# EAGLE design myRIO circuit breakout (EAGLE 9.5.0)
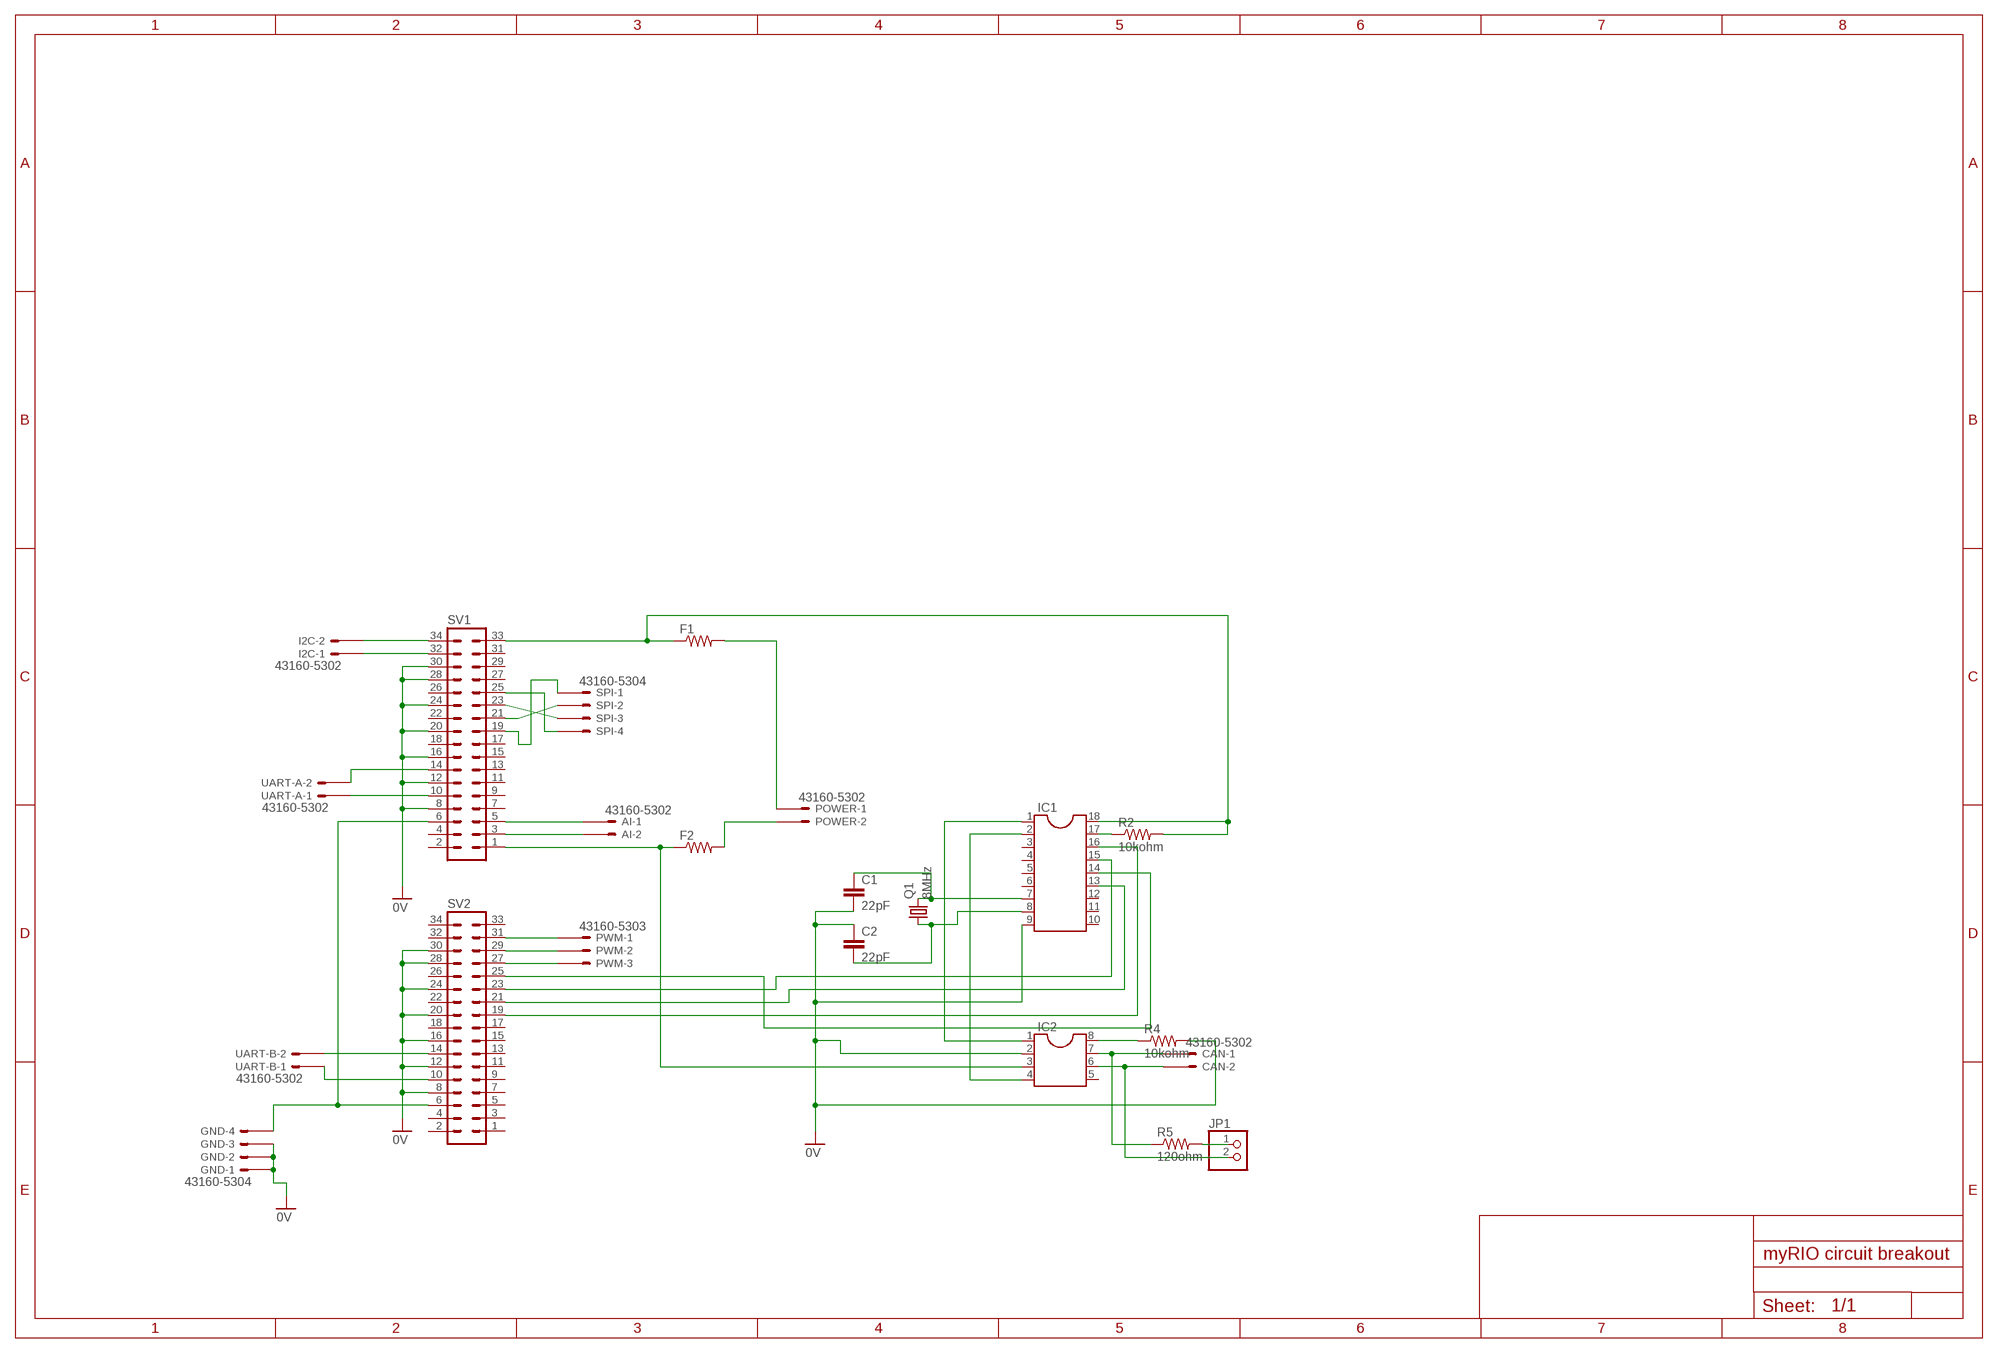
[diagram p0: schematic, sheet 1]

## Parts
AI  43160-5302  [43160-XX02]
C1  22pF  C2,5-3  [C2.5-3]
C2  22pF  C2,5-3  [C2.5-3]
CAN  43160-5302  [43160-XX02]
F1  R-US_R1206  [R1206]
F2  R-US_R1206  [R1206]
GND  43160-5304  [43160-XX04]
I2C  43160-5302  [43160-XX02]
IC1  DIL18  [DIL18]
IC2  DIL8  [DIL08]
JP1  PINHD-1X2  [1X02]
POWER  43160-5302  [43160-XX02]
PWM  43160-5303  [43160-XX03]
Q1  8MHz  CRYSTALHC49S  [HC49/S]
R2  10kohm  R-US_0204/7  [0204/7]
R4  10kohm  R-US_0204/7  [0204/7]
R5  120ohm  R-US_0204/7  [0204/7]
SPI  43160-5304  [43160-XX04]
SV1  MA17-2  [MA17-2]
SV2  MA17-2  [MA17-2]
UART-A  43160-5302  [43160-XX02]
UART-B  43160-5302  [43160-XX02]

## Nets
0V: C1.2 C2.1 GND.1@1(-1:S) GND.2@1(-2:S) GND.3@1(-3:S) IC1.9 IC2.2 R4.2 SV1.8 SV1.12 SV1.16 SV1.20 SV1.24 SV1.28 SV1.30 SV2.8 SV2.12 SV2.16 SV2.20 SV2.24 SV2.28 SV2.30
N$1: I2C.2@1(-2:S) SV1.34
N$2: I2C.1@1(-1:S) SV1.32
N$3: SPI.4@1(-4:S) SV1.25
N$4: SPI.2@1(-2:S) SV1.21
N$5: SPI.3@1(-3:S) SV1.23
N$6: SPI.1@1(-1:S) SV1.19
N$7: AI.2@1(-2:S) SV1.3
N$8: AI.1@1(-1:S) SV1.5
N$9: JP1.1 R5.2
N$11: SV1.10 UART-A.1@1(-1:S)
N$12: SV1.14 UART-A.2@1(-2:S)
N$13: SV2.10 UART-B.1@1(-1:S)
N$14: SV2.14 UART-B.2@1(-2:S)
N$15: GND.4@1(-4:S) SV1.6 SV2.6
N$16: IC1.1 IC2.1
N$17: IC1.2 IC2.4
N$18: C1.1 IC1.7 Q1.2
N$20: PWM.1@1(-1:S) SV2.31
N$21: PWM.2@1(-2:S) SV2.29
N$22: PWM.3@1(-3:S) SV2.27
N$26: F1.1 IC1.18 R2.2 SV1.33
N$27: F1.2 POWER.1@1(-1:S)
N$28: F2.1 IC2.3 SV1.1
N$29: F2.2 POWER.2@1(-2:S)
N$30: C2.2 IC1.8 Q1.1
N$31: IC1.17 R2.1
N$32: IC1.16 SV2.19
N$33: IC1.13 SV2.21
N$34: IC1.15 SV2.23
N$35: IC1.14 SV2.25
N$36: IC2.8 R4.1
N$37: CAN.1@1(-1:S) IC2.7 R5.1
N$38: CAN.2@1(-2:S) IC2.6 JP1.2
Unconnected: AI.1@2(-1:S) AI.2@2(-2:S) CAN.1@2(-1:S) CAN.2@2(-2:S) GND.1@2(-1:S) GND.2@2(-2:S) GND.3@2(-3:S) GND.4@2(-4:S) I2C.1@2(-1:S) I2C.2@2(-2:S) IC1.3 IC1.4 IC1.5 IC1.6 IC1.10 IC1.11 IC1.12 IC2.5 POWER.1@2(-1:S) POWER.2@2(-2:S) PWM.1@2(-1:S) PWM.2@2(-2:S) PWM.3@2(-3:S) SPI.1@2(-1:S) SPI.2@2(-2:S) SPI.3@2(-3:S) SPI.4@2(-4:S) SV1.2 SV1.4 SV1.7 SV1.9 SV1.11 SV1.13 SV1.15 SV1.17 SV1.18 SV1.22 SV1.26 SV1.27 SV1.29 SV1.31 SV2.1 SV2.2 SV2.3 SV2.4 SV2.5 SV2.7 SV2.9 SV2.11 SV2.13 SV2.15 SV2.17 SV2.18 SV2.22 SV2.26 SV2.32 SV2.33 SV2.34 UART-A.1@2(-1:S) UART-A.2@2(-2:S) UART-B.1@2(-1:S) UART-B.2@2(-2:S)

## Library data of the parts
AI CAN I2C POWER UART-A UART-B = con-molex:43160-*02: SDA-43160 Connector Source: http://www.molex.com/pdm_docs/sd/431601306_sd.pdf; MF: MOLEX; MPN: 43160-5302; OC_FARNELL: unknown; OC_NEWARK: 92M1498
C1 C2 = capacitor-wima:C: CAPACITOR naming: grid - package width
F1 F2 R2 R4 R5 = rcl:R-US_: RESISTOR, American symbol; SPICEPREFIX: R
GND SPI = con-molex:43160-*04: SDA-43160 Connector Source: http://www.molex.com/pdm_docs/sd/431601306_sd.pdf; MF: MOLEX; MPN: 43160-5304; OC_FARNELL: unknown; OC_NEWARK: 92M1500
IC1 = ic-package:DIL18: Dual In Line / Socket
IC2 = ic-package:DIL8: Dual In Line / Socket
JP1 = pinhead:PINHD-1X2: PIN HEADER
PWM = con-molex:43160-*03: SDA-43160 Connector Source: http://www.molex.com/pdm_docs/sd/431601306_sd.pdf; MF: MOLEX; MPN: 43160-5303; OC_FARNELL: unknown; OC_NEWARK: 92M1499
Q1 = crystal:CRYSTAL: CRYSTAL; OC_FARNELL: 1667008; OC_NEWARK: unknown
SV1 SV2 = con-lstb:MA17-2: PIN HEADER; OC_FARNELL: unknown; OC_NEWARK: unknown

## Module TSS
Ports: 

### Library data of the parts

## Board
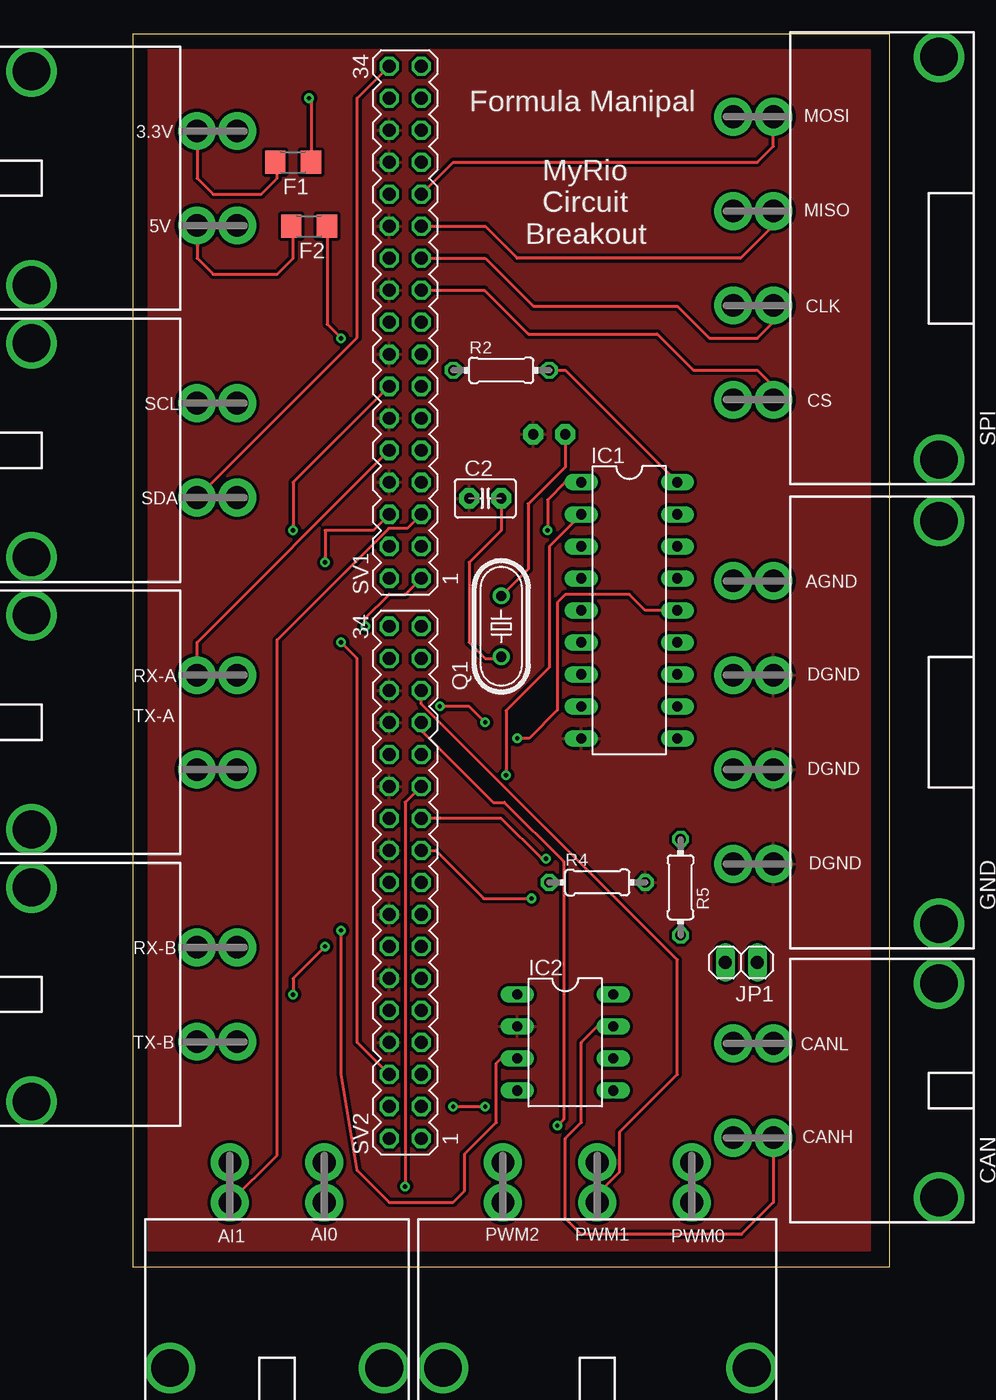
[diagram p1: board, top side]
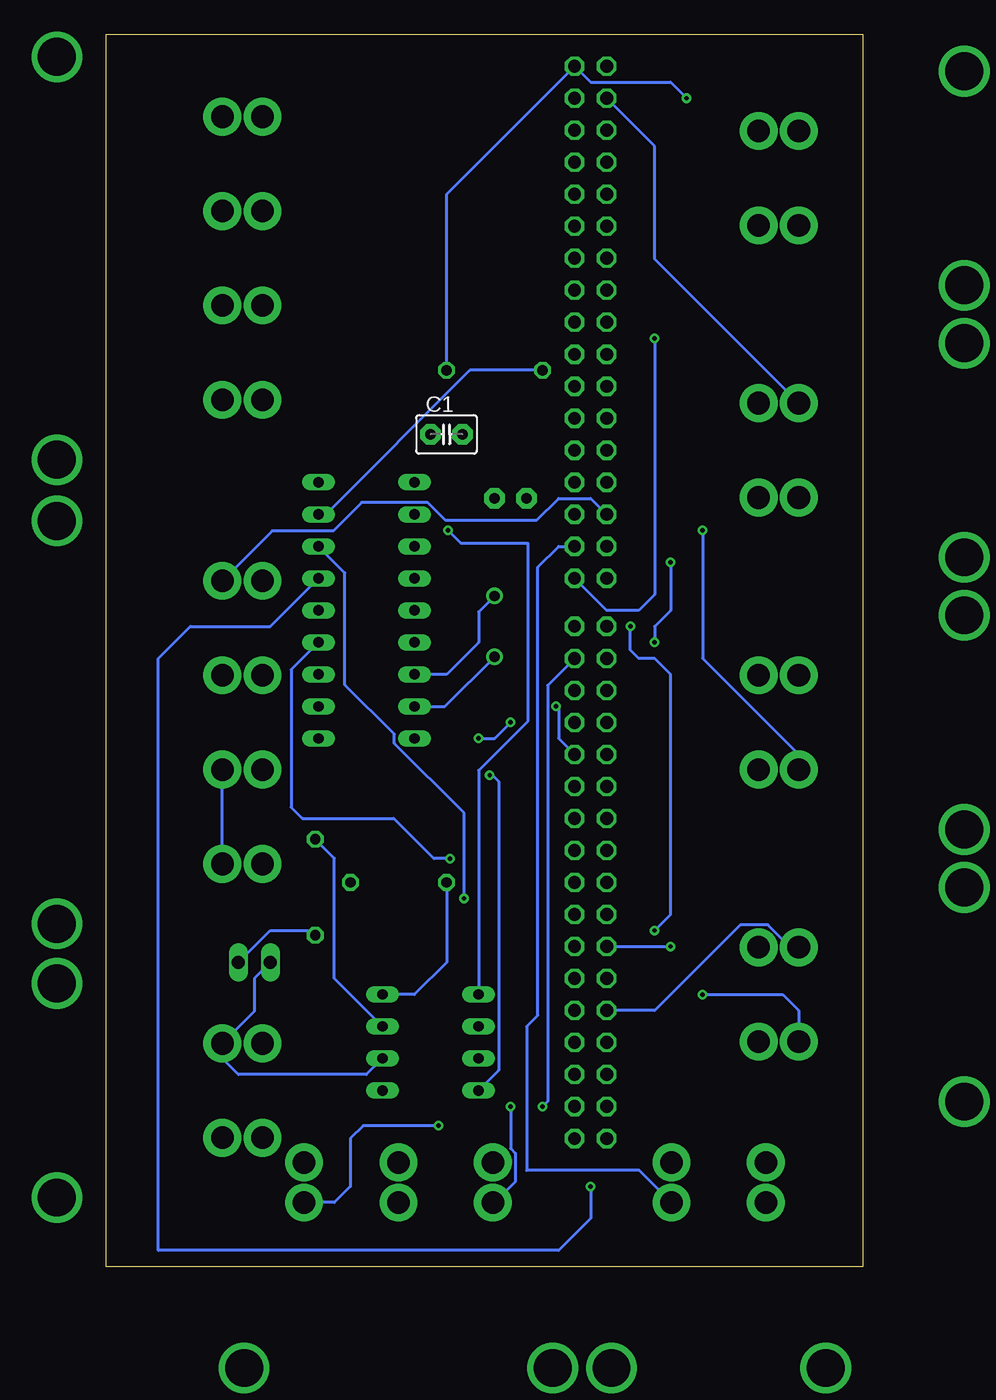
[diagram p2: board, bottom side, seen from below]

Size 60.02 x 97.78 mm. Coordinates in mm from the lower left corner, seen from the top.
Outline: 0,0 60.02,0 60.02,97.78 0,97.78 0,0
Copper layers (1*16): Top 0.035mm / dielectric 1.5mm / Bottom 0.035mm
Design rules "default": minimum track width 6mil, minimum drill 0.35mm, track to track 6mil, track to pad 6mil, pad to pad 6mil, via to via 6mil, smd to smd 6mil, copper to edge 40mil, drill to drill 6mil, minimum pad ring 10mil, minimum via ring 8mil, stop-mask expansion 4mil, vias tented up to drill 0mil, thermal gap 10mil

### Footprints (pad centres in the part's own frame; a part is rotated, then mirrored left to right if it is on the bottom)
43160-XX02 = drill 1.8 pad 3: 1@1 -3.745,0; 1@2 -3.745,3.18; 2@1 3.745,0; 2@2 3.745,3.18 | drill 3 pad 3.4: M1 -8.495,-13.13; M2 8.495,-13.13
C2.5-3 = drill 0.813 pad 1.6 octagon: 1 -1.27,0; 2 1.27,0
R1206 = smd 1.6 x 1.803: 1 -1.422,0; 2 1.422,0
43160-XX04 = drill 1.8 pad 3: 1@1 -11.235,0; 1@2 -11.235,3.18; 2@1 -3.745,0; 2@2 -3.745,3.18; 3@1 3.745,0; 3@2 3.745,3.18; 4@1 11.235,0; 4@2 11.235,3.18 | drill 3 pad 3.4: M1 -15.985,-13.13; M2 15.985,-13.13
DIL18 = drill 0.813 long: 1 -10.16,-3.81; 2 -7.62,-3.81; 3 -5.08,-3.81; 4 -2.54,-3.81; 5 0,-3.81; 6 2.54,-3.81; 7 5.08,-3.81; 8 7.62,-3.81; 9 10.16,-3.81; 10 10.16,3.81; 11 7.62,3.81; 12 5.08,3.81; 13 2.54,3.81; 14 0,3.81; 15 -2.54,3.81; 16 -5.08,3.81; 17 -7.62,3.81; 18 -10.16,3.81
DIL08 = drill 0.813 long: 1 -3.81,-3.81; 2 -1.27,-3.81; 3 1.27,-3.81; 4 3.81,-3.81; 5 3.81,3.81; 6 1.27,3.81; 7 -1.27,3.81; 8 -3.81,3.81
1X02 = drill 1.016 long: 1 -1.27,0; 2 1.27,0
43160-XX03 = drill 1.8 pad 3: 1@1 -7.49,0; 1@2 -7.49,3.18; 2@1 0,0; 2@2 0,3.18; 3@1 7.49,0; 3@2 7.49,3.18 | drill 3 pad 3.4: M1 -12.24,-13.13; M2 12.24,-13.13
HC49/S = drill 0.813: 1 -2.413,0; 2 2.413,0
0204/7 = drill 0.813 octagon: 1 -3.81,0; 2 3.81,0
MA17-2 = drill 1.016 octagon: 1 -20.32,-1.27; 2 -20.32,1.27; 3 -17.78,-1.27; 4 -17.78,1.27; 5 -15.24,-1.27; 6 -15.24,1.27; 7 -12.7,-1.27; 8 -12.7,1.27; 9 -10.16,-1.27; 10 -10.16,1.27; 11 -7.62,-1.27; 12 -7.62,1.27; 13 -5.08,-1.27; 14 -5.08,1.27; 15 -2.54,-1.27; 16 -2.54,1.27; 17 0,-1.27; 18 0,1.27; 19 2.54,-1.27; 20 2.54,1.27; 21 5.08,-1.27; 22 5.08,1.27; 23 7.62,-1.27; 24 7.62,1.27; 25 10.16,-1.27; 26 10.16,1.27; 27 12.7,-1.27; 28 12.7,1.27; 29 15.24,-1.27; 30 15.24,1.27; 31 17.78,-1.27; 32 17.78,1.27; 33 20.32,-1.27; 34 20.32,1.27

### Placement (x,y rotation side)
AI  11.43,5.08 0 top
C1  33.02,66.04 0 bottom
C2  27.94,60.96 0 top
CAN  50.8,13.97 90 top
F1  12.7,87.63 180 top
F2  13.97,82.55 180 top
GND  50.8,43.18 90 top
I2C  5.08,64.77 270 top
IC1  39.37,52.07 270 top
IC2  34.29,17.78 270 top
JP1  48.26,24.13 180 top
POWER  5.08,86.36 270 top
PWM  36.83,5.08 0 top
Q1  29.21,50.8 90 top
R2  29.21,71.12 0 top
R4  36.83,30.48 0 top
R5  43.43,30.1 270 top
SPI  50.8,80.01 90 top
SV1  21.59,74.93 90 top
SV2  21.59,30.48 90 top
UART-A  5.08,43.18 270 top
UART-B  5.08,21.59 270 top

### Tracks (layer width: path | path; a pad name or v marks a point on that pad's centre or on a via)
0V
  Bottom 0.254: GND.1@1 GND.2@1
  pour Top (isolate 0.254): 1.27,96.52 58.42,96.52 58.42,1.27 1.27,1.27
N$1
  Top 0.254: I2C.2@1 17.78,73.72 17.78,92.71 SV1.34
N$2
  Bottom 0.254: I2C.1@1 16.51,79.94 16.51,88.9 SV1.32
N$3
  Top 0.254: SV1.25 25.4,87.63 49.53,87.63 50.8,88.9 SPI.4@1
N$4
  Top 0.254: SV1.21 27.94,80.01 31.75,76.2 43.18,76.2 45.72,73.66 49.53,73.66 50.8,74.93 SPI.2@1
N$5
  Top 0.254: SV1.23 27.94,82.55 30.48,80.01 48.19,80.01 50.8,82.62 SPI.3@1
N$6
  Top 0.254: SV1.19 27.88,77.47 31.36,73.99 41.58,73.99 44.45,71.12 49.53,71.12 50.8,69.85 SPI.1@1
N$7
  Bottom 0.254: AI.2@1 17.71,7.62 26.67,7.62 26.67,19.05 25.78,19.94 25.78,55.5 24.13,57.15 SV1.3
N$8
  Top 0.254: AI.1@1 11.43,8.82 11.43,49.73 20.27,58.57 21.74,58.57 SV1.5
N$9
  Bottom 0.254: JP1.1 46.99,26.67 43.81,26.67 R5.2
N$11
  Top 0.254: UART-A.1@1 5.08,49.53 SV1.10
N$12  (via drill 0.35)
  Top 0.254: SV1.14 12.7,62.23 v12.7,58.42
  Bottom 0.254: v12.7,58.42 12.7,48.26 5.08,40.64 UART-A.2@1
N$13
  Bottom 0.254: UART-B.1@1 5.74,25.34 7.52,27.11 9.72,27.11 16.51,20.32 SV2.10
N$14  (via drill 0.35)
  Top 0.254: v15.24,25.4 12.7,22.86 v12.7,21.59
  Bottom 0.254: SV2.14 v15.24,25.4 | v12.7,21.59 6.35,21.59 5.08,20.32 UART-B.2@1
N$15  (via drill 0.35)
  Top 0.254: SV2.6 17.78,17.78 17.78,48.26 v16.51,49.53 | SV1.6 19.05,58.42 15.24,58.42 v15.24,55.88
  Bottom 0.254: GND.4@1 46.85,58.37 42,58.37 39.74,60.63 34.51,60.63 33.13,59.24 25.85,59.24 24.13,60.96 21.59,60.96 SV1.6 | v15.24,55.88 15.24,52.07 16.51,50.8 v16.51,49.53
N$16  (via drill 0.35)
  Top 0.254: IC1.1 34.29,62.23 32.89,60.83 v32.89,58.42
  Bottom 0.254: IC2.1 30.48,39.37 26.54,43.31 26.54,57.4 31.88,57.4 v32.89,58.42
N$17  (via drill 0.35)
  Top 0.254: v29.59,38.99 29.59,44.11 33.02,47.54 33.02,57.15 IC1.2
  Bottom 0.254: v29.59,38.99 29.38,38.99 28.88,38.49 28.88,15.57 IC2.4
N$18
  Top 0.254: C1.1 34.29,63.46 31.34,60.51 31.34,55.35 Q1.2
  Bottom 0.254: Q1.2 30.48,51.94 30.48,49.53 33.02,46.99 IC1.7
N$20  (via drill 0.35)
  Top 0.254: v25.4,12.7 v27.94,12.7
  Bottom 0.254: PWM.1@1 29.28,5.02 27.56,6.73 27.56,9 27.94,9.38 v27.94,12.7 | SV2.31 24.99,46.13 24.99,13.11 v25.4,12.7
N$21
  Top 0.254: PWM.2@1 36.83,5.74 38.61,7.52 38.61,10.67 43.18,15.24 43.18,24.33 22.86,44.65 SV2.29
N$22  (via drill 0.35)
  Top 0.254: SV2.27 22.86,42.55 28.57,36.83 29.46,36.83 34.16,32.13 34.16,11.68 v33.66,11.18
  Bottom 0.254: v33.66,11.18 39.62,11.18 40.64,10.16 40.64,6.35 41.91,5.08 PWM.3@1
N$26  (via drill 0.35)
  Top 0.254: IC1.18 34.29,71.12 R2.2 | v13.97,92.71 14.12,92.56 F1.1
  Bottom 0.254: R2.2 33.02,85.09 SV1.33 21.59,93.98 15.24,93.98 v13.97,92.71
N$27
  Top 0.254: POWER.1@1 5.08,86.36 6.35,85.09 10.16,85.09 11.43,86.36 11.43,87.48 F1.2
N$28  (via drill 0.35)
  Top 0.254: IC2.3 29.21,16.51 28.83,16.13 28.83,11.43 26.29,8.89 26.29,5.97 25.4,5.08 20.32,5.08 17.78,7.62 16.51,15.24 v16.51,26.67 | F2.1 15.39,74.78 v16.51,73.66 | v18.44,50.8 18.44,51.46 20.32,53.34 21.59,53.34 SV1.1
  Bottom 0.254: v16.51,73.66 16.51,53.34 17.78,52.07 20.32,52.07 SV1.1 | v16.51,26.67 15.24,27.94 15.24,46.99 16.51,48.26 17.78,48.26 18.44,48.92 v18.44,50.8
N$29
  Top 0.254: POWER.2@1 5.08,80.01 6.35,78.74 11.43,78.74 12.7,80.01 12.7,82.4 F2.2
N$30
  Top 0.254: C2.2 29.21,58.42 26.67,55.88 26.67,49.53 27.94,48.26 29.08,48.26 Q1.1
  Bottom 0.254: IC1.8 33.15,44.45 Q1.1
N$31
  Bottom 0.254: R2.1 31.16,71.12 42.59,59.69 IC1.17
N$32  (via drill 0.35)
  Top 0.254: SV2.19 24,33.02 27.81,29.21 v31.62,29.21
  Bottom 0.254: v31.62,29.21 31.62,35.98 37.16,41.52 37.16,42.24 41.07,46.15 41.07,55.04 IC1.16
N$33  (via drill 0.35)
  Top 0.254: v32.75,32.37 32.41,32.37 29.21,35.56 SV2.21
  Bottom 0.254: IC1.13 45.34,47.37 45.34,36.45 44.45,35.56 37.21,35.56 34.02,32.37 v32.75,32.37
N$34  (via drill 0.35)
  Top 0.254: SV2.23 21.59,36.83 v21.59,6.35
  Bottom 0.254: v21.59,6.35 21.59,3.81 24.13,1.27 55.88,1.27 55.88,48.26 53.34,50.8 46.99,50.8 IC1.15
N$35  (via drill 0.35)
  Top 0.254: IC1.14 40.64,52.07 39.37,53.34 34.29,53.34 33.66,52.71 33.66,44.15 31.42,41.91 v30.48,41.91 | v27.94,43.18 26.67,44.45 v24.34,44.45
  Bottom 0.254: v30.48,41.91 29.21,41.91 v27.94,43.18 | v24.34,44.45 24.13,44.24 24.13,41.91 SV2.25
N$36
  Bottom 0.254: R4.1 33.02,24.13 35.56,21.59 IC2.8
N$37
  Top 0.254: CAN.1@1 50.8,5.08 48.26,2.54 35.56,2.54 34.29,3.81 34.29,10.16 35.56,11.43 35.56,17.78 36.83,19.05 IC2.7
  Bottom 0.254: IC2.7 41.91,22.86 41.91,32.38 R5.1
N$38
  Bottom 0.254: IC2.6 39.37,15.24 49.53,15.24 50.8,16.51 CAN.2@1 48.26,20.25 48.26,22.86 JP1.2

### Text on the board
tPlace: MOSI | 3.3V | Formula Manipal | MISO | 5V | MyRio / Circuit / Breakout | CLK | CS | SCL | SDA | AGND | RX-A | DGND | TX-A | DGND | DGND | RX-B | TX-B | CANL | CANH | AI1 | AI0 | PWM2 | PWM1 | PWM0